# EAGLE schematic spicboard2 (EAGLE 7.3.0)
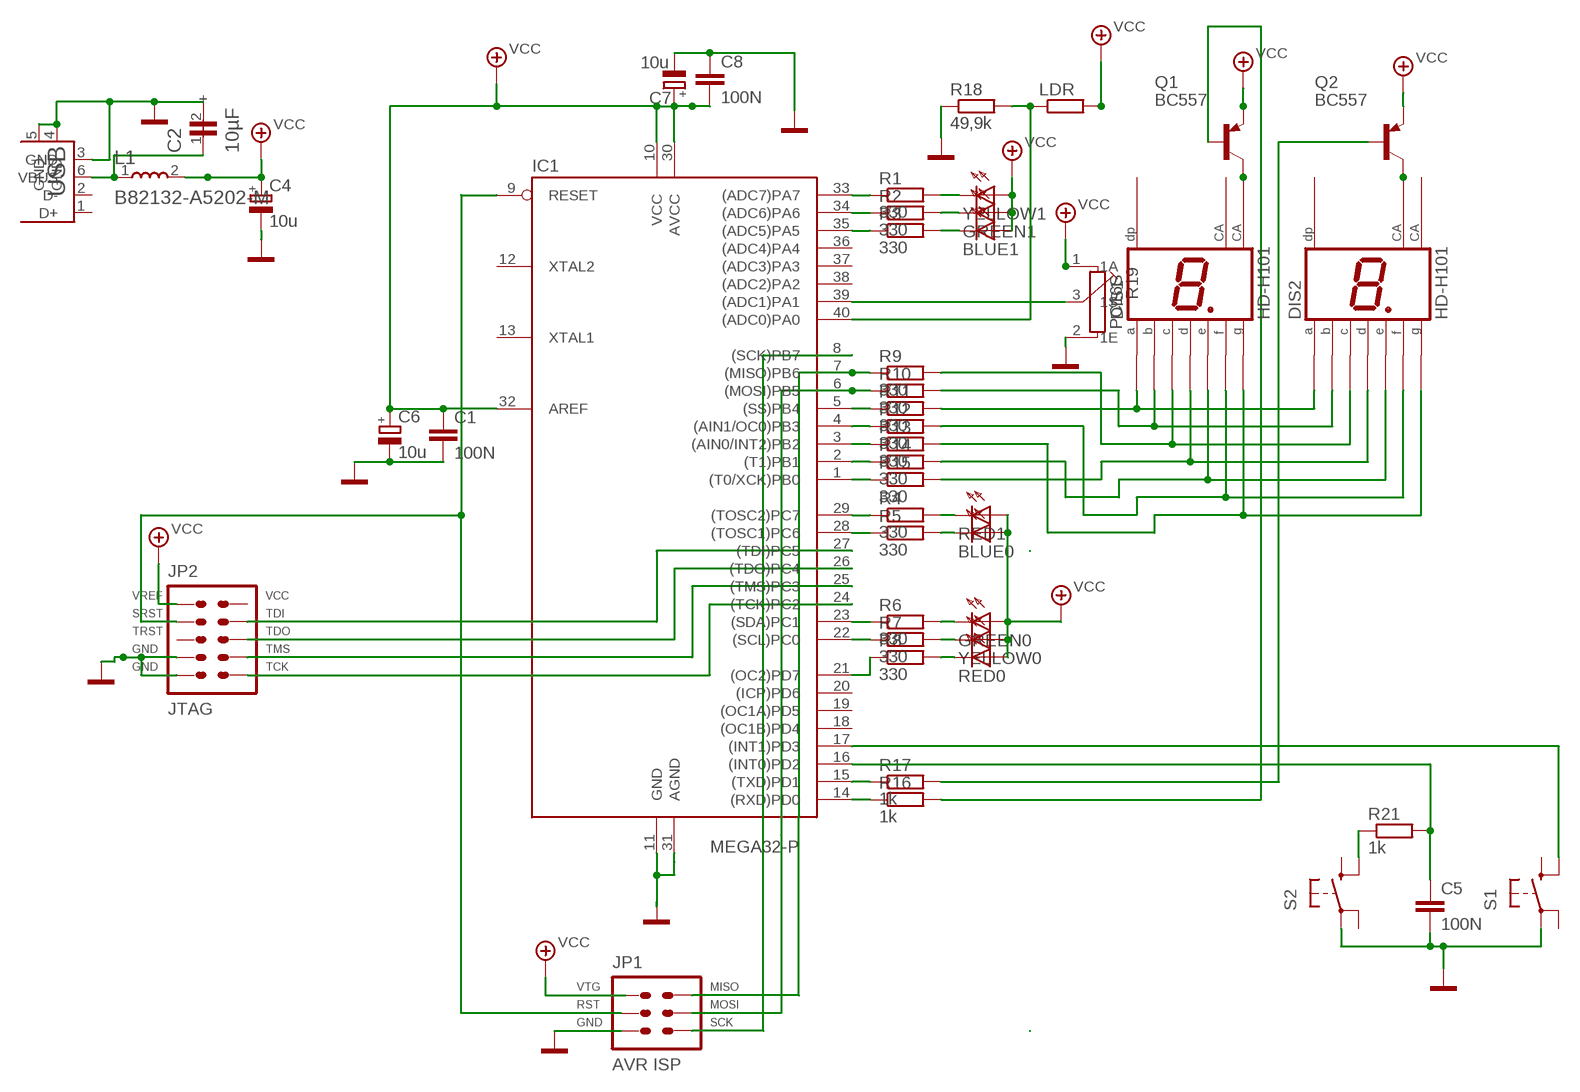
[diagram p0: schematic, sheet 1]

## Parts
BLUE0  #  #_0  [#_0]
BLUE1  #  #_1  [#_1]
C1  100N  #_2  [#_2]
C2  10µF  489D_25V_10µF_66  [D6R2,54_ELKO_66]
C4  10u  #_3  [#_3]
C5  100N  #_4  [#_4]
C6  10u  #_5  [#_5]
C7  10u  #_6  [#_6]
C8  100N  #_7  [#_7]
DIS1  HD-H101  #_8  [#_8]
DIS2  HD-H101  #_9  [#_9]
GREEN0  #  #_10  [#_10]
GREEN1  #  #_11  [#_11]
IC1  MEGA32-P  #_12  [#_12]
JP1  AVR-ISP-6  #_13  [#_13]
JP2  AVR-JTAG-10  #_14  [#_14]
L1  B82132-A5202-M  B82132-A5202-M_61  [6X19R22,86_61]
LDR0  #  #_15  [#_15]
Q1  BC557  #_16  [#_16]
Q2  BC557  #_17  [#_17]
R1  330  #_18  [#_18]
R2  330  #_19  [#_19]
R3  330  #_20  [#_20]
R4  330  #_21  [#_21]
R5  330  #_22  [#_22]
R6  330  #_23  [#_23]
R7  330  #_24  [#_24]
R8  330  #_25  [#_25]
R9  330  #_26  [#_26]
R10  330  #_27  [#_27]
R11  330  #_28  [#_28]
R12  330  #_29  [#_29]
R13  330  #_30  [#_30]
R14  330  #_31  [#_31]
R15  330  #_32  [#_32]
R16  1k  #_33  [#_33]
R17  1k  #_34  [#_34]
R18  49,9k  #_35  [#_35]
R19  PC16S  #_36  [#_36]
R21  1k  #_37  [#_37]
RED0  #  #_38  [#_38]
RED1  #  #_39  [#_39]
S1  #  #_40  [#_40]
S2  #  #_41  [#_41]
USB1  USB-B-H  #_42  [#_42]
YELLOW0  #  #_43  [#_43]
YELLOW1  #  #_44  [#_44]

## Nets
(INT0)PD2: R21.1 S2.2
GND: C1.2 C2.2(-) C4.2 C5.2 C6.2 C7.2 C8.1 IC1.11(GND) IC1.31(AGND) JP1.6 JP2.2 JP2.10 R18.1 R19.2(1E) S1.3 S2.3 USB1.3(GND) USB1.4(GND) USB1.5(GND)
N$1: IC1.40((ADC0)PA0) LDR0.1 R18.2
N$2: R1.2 YELLOW1.2
N$3: GREEN1.2 R2.2
N$4: BLUE1.2 R3.2
N$5: R4.2 RED1.2
N$6: BLUE0.2 R5.2
N$7: GREEN0.2 R6.2
N$8: R7.2 YELLOW0.2
N$9: R8.2 RED0.2
N$10: IC1.7((MISO)PB6) JP1.1 R9.1
N$11: IC1.6((MOSI)PB5) JP1.4 R10.1
N$12: IC1.5((SS)PB4) R11.1
N$13: IC1.4((AIN1/OC0)PB3) R12.1
N$14: IC1.3((AIN0/INT2)PB2) R13.1
N$15: IC1.2((T1)PB1) R14.1
N$16: IC1.1((T0/XCK)PB0) R15.1
N$17: IC1.33((ADC7)PA7) R1.1
N$18: IC1.34((ADC6)PA6) R2.1
N$19: IC1.35((ADC5)PA5) R3.1
N$20: IC1.29((TOSC2)PC7) R4.1
N$21: IC1.28((TOSC1)PC6) R5.1
N$22: IC1.27((TDI)PC5) JP2.9
N$23: IC1.26((TDO)PC4) JP2.3
N$24: IC1.25((TMS)PC3) JP2.5
N$25: DIS1.7 DIS2.7 R11.2
N$26: DIS1.6 DIS2.6 R10.2
N$27: DIS1.4 DIS2.4 R9.2
N$28: DIS1.2 DIS2.2 R15.2
N$29: DIS1.1 DIS2.1 R14.2
N$30: IC1.24((TCK)PC2) JP2.1
N$31: DIS1.10 DIS2.10 R13.2
N$34: IC1.14((RXD)PD0) R16.1
N$35: IC1.15((TXD)PD1) R17.1
N$36: Q1.1 R16.2
N$37: Q2.1 R17.2
N$38: IC1.21((OC2)PD7) R8.1
N$39: IC1.17((INT1)PD3) S1.2
N$40: IC1.39((ADC1)PA1) R19.3(1S)
N$41: DIS1.9 DIS2.9 R12.2
N$42: IC1.8((SCK)PB7) JP1.3
N$43: C5.1 IC1.16((INT0)PD2) R21.2
N$44: IC1.9(RESET) JP1.5 JP2.6
N$46: IC1.22((SCL)PC0) R7.1
N$47: IC1.23((SDA)PC1) R6.1
VBUS: C2.1(+) L1.1 USB1.6(VBUS)
VCC: BLUE0.1 BLUE1.1 C1.1 C4.1 C6.1 C7.1 C8.2 GREEN0.1 GREEN1.1 IC1.10(VCC) IC1.30(AVCC) IC1.32(AREF) JP1.2 JP2.4 L1.2 LDR0.2 Q1.3 Q2.3 R19.1(1A) RED0.1 RED1.1 YELLOW0.1 YELLOW1.1
Unconnected: DIS1.3 DIS1.5 DIS1.8 DIS2.3 DIS2.5 DIS2.8 IC1.12(XTAL2) IC1.13(XTAL1) IC1.18((OC1B)PD4) IC1.19((OC1A)PD5) IC1.20((ICP)PD6) IC1.36((ADC4)PA4) IC1.37((ADC3)PA3) IC1.38((ADC2)PA2) JP2.7 JP2.8 Q1.2 Q2.2 S1.1 S1.4 S2.1 S2.4 USB1.1(D+) USB1.2(D-)

## Library data of the parts
BLUE0 = TARGET3001!_V18.4.0.4:#_0
BLUE1 = TARGET3001!_V18.4.0.4:#_1
C1 = TARGET3001!_V18.4.0.4:#_2
C2 = TARGET3001!_V18.4.0.4:489D_25V_10µF_66
C4 = TARGET3001!_V18.4.0.4:#_3
C5 = TARGET3001!_V18.4.0.4:#_4
C6 = TARGET3001!_V18.4.0.4:#_5
C7 = TARGET3001!_V18.4.0.4:#_6
C8 = TARGET3001!_V18.4.0.4:#_7
DIS1 = TARGET3001!_V18.4.0.4:#_8
DIS2 = TARGET3001!_V18.4.0.4:#_9
GREEN0 = TARGET3001!_V18.4.0.4:#_10
GREEN1 = TARGET3001!_V18.4.0.4:#_11
IC1 = TARGET3001!_V18.4.0.4:#_12
JP1 = TARGET3001!_V18.4.0.4:#_13
JP2 = TARGET3001!_V18.4.0.4:#_14
L1 = TARGET3001!_V18.4.0.4:B82132-A5202-M_61
LDR0 = TARGET3001!_V18.4.0.4:#_15
Q1 = TARGET3001!_V18.4.0.4:#_16
Q2 = TARGET3001!_V18.4.0.4:#_17
R1 = TARGET3001!_V18.4.0.4:#_18
R2 = TARGET3001!_V18.4.0.4:#_19
R3 = TARGET3001!_V18.4.0.4:#_20
R4 = TARGET3001!_V18.4.0.4:#_21
R5 = TARGET3001!_V18.4.0.4:#_22
R6 = TARGET3001!_V18.4.0.4:#_23
R7 = TARGET3001!_V18.4.0.4:#_24
R8 = TARGET3001!_V18.4.0.4:#_25
R9 = TARGET3001!_V18.4.0.4:#_26
R10 = TARGET3001!_V18.4.0.4:#_27
R11 = TARGET3001!_V18.4.0.4:#_28
R12 = TARGET3001!_V18.4.0.4:#_29
R13 = TARGET3001!_V18.4.0.4:#_30
R14 = TARGET3001!_V18.4.0.4:#_31
R15 = TARGET3001!_V18.4.0.4:#_32
R16 = TARGET3001!_V18.4.0.4:#_33
R17 = TARGET3001!_V18.4.0.4:#_34
R18 = TARGET3001!_V18.4.0.4:#_35
R19 = TARGET3001!_V18.4.0.4:#_36
R21 = TARGET3001!_V18.4.0.4:#_37
RED0 = TARGET3001!_V18.4.0.4:#_38
RED1 = TARGET3001!_V18.4.0.4:#_39
S1 = TARGET3001!_V18.4.0.4:#_40
S2 = TARGET3001!_V18.4.0.4:#_41
USB1 = TARGET3001!_V18.4.0.4:#_42
YELLOW0 = TARGET3001!_V18.4.0.4:#_43
YELLOW1 = TARGET3001!_V18.4.0.4:#_44